# Altium project 模拟有线充电.PrjPcb
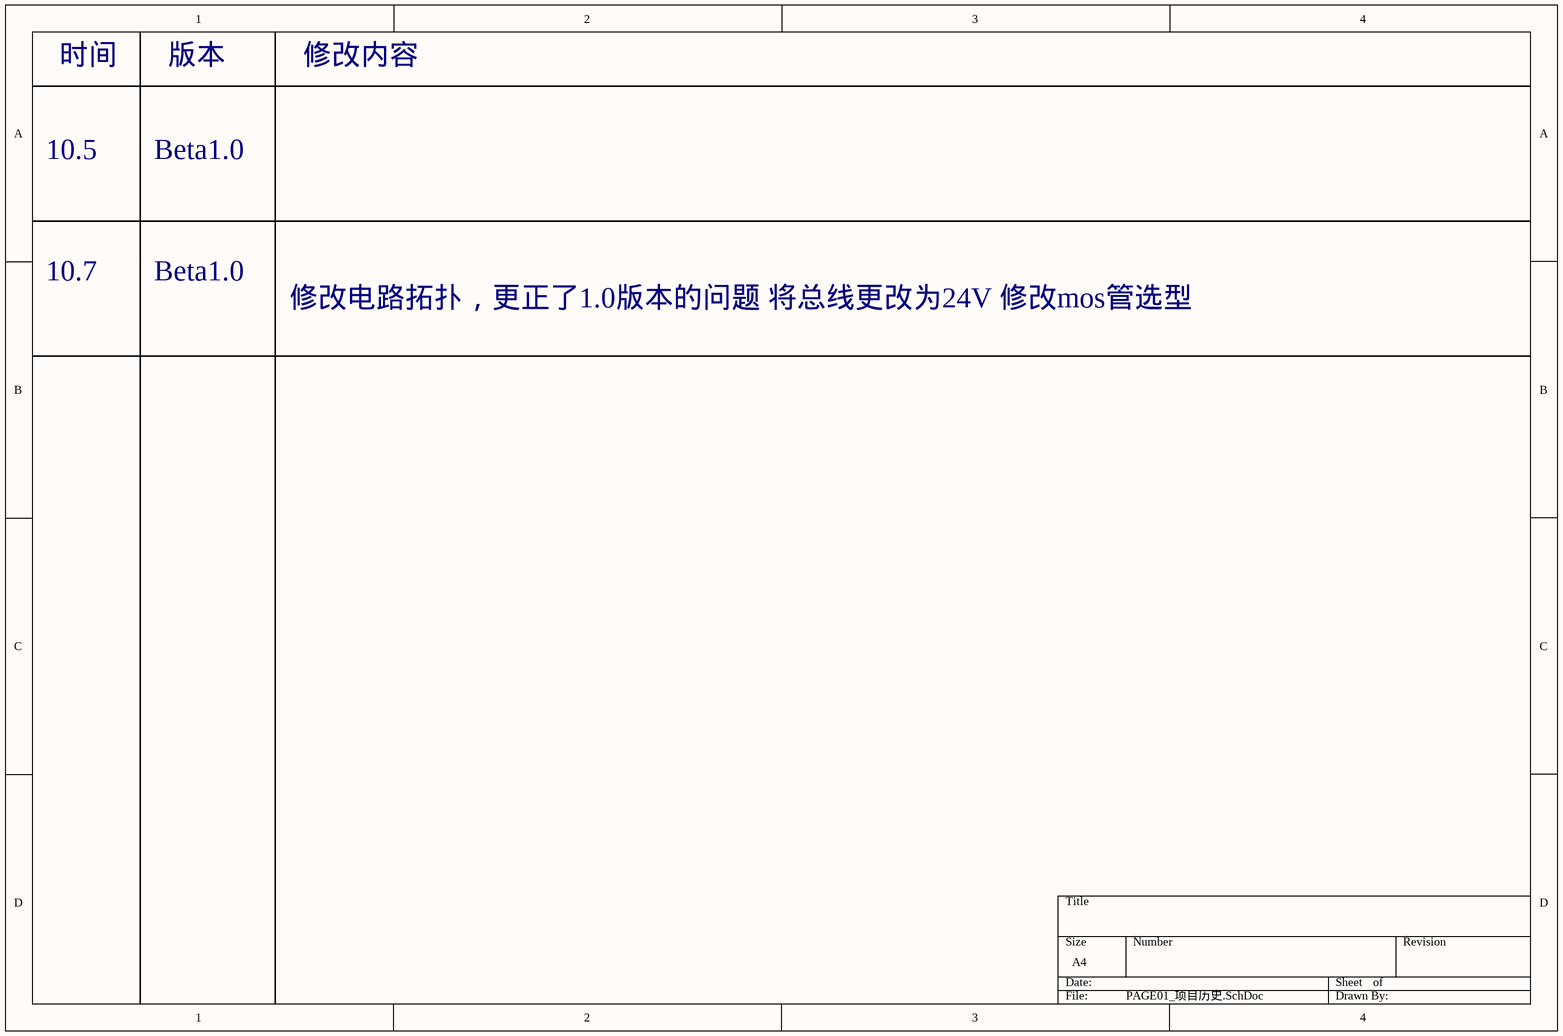
[diagram p0: PAGE01_项目历史.SchDoc]
6 sheets, 90 parts. Net scope: global (net labels, ports and power ports of the same name join across sheets).
Board file: PCB1.PcbDoc
Sheets:
  PAGE01_项目历史.SchDoc
  PAGE02_机场端电源.SchDoc
  PAGE03_机场端单片机.SchDoc
  PAGE04_飞机端BMS.SchDoc
  PAGE05_机场端协议.SchDoc
  PAGE06_握手协议飞机端.SchDoc

## Sheet PAGE01_项目历史.SchDoc
size A4

### Notes on the sheet
- 时间
- 版本
- 修改内容
- 10.5
- Beta1.0
- 10.7
- 修改电路拓扑，更正了1.0版本的问题 将总线更改为24V 修改mos管选型

## Sheet PAGE02_机场端电源.SchDoc
size A4
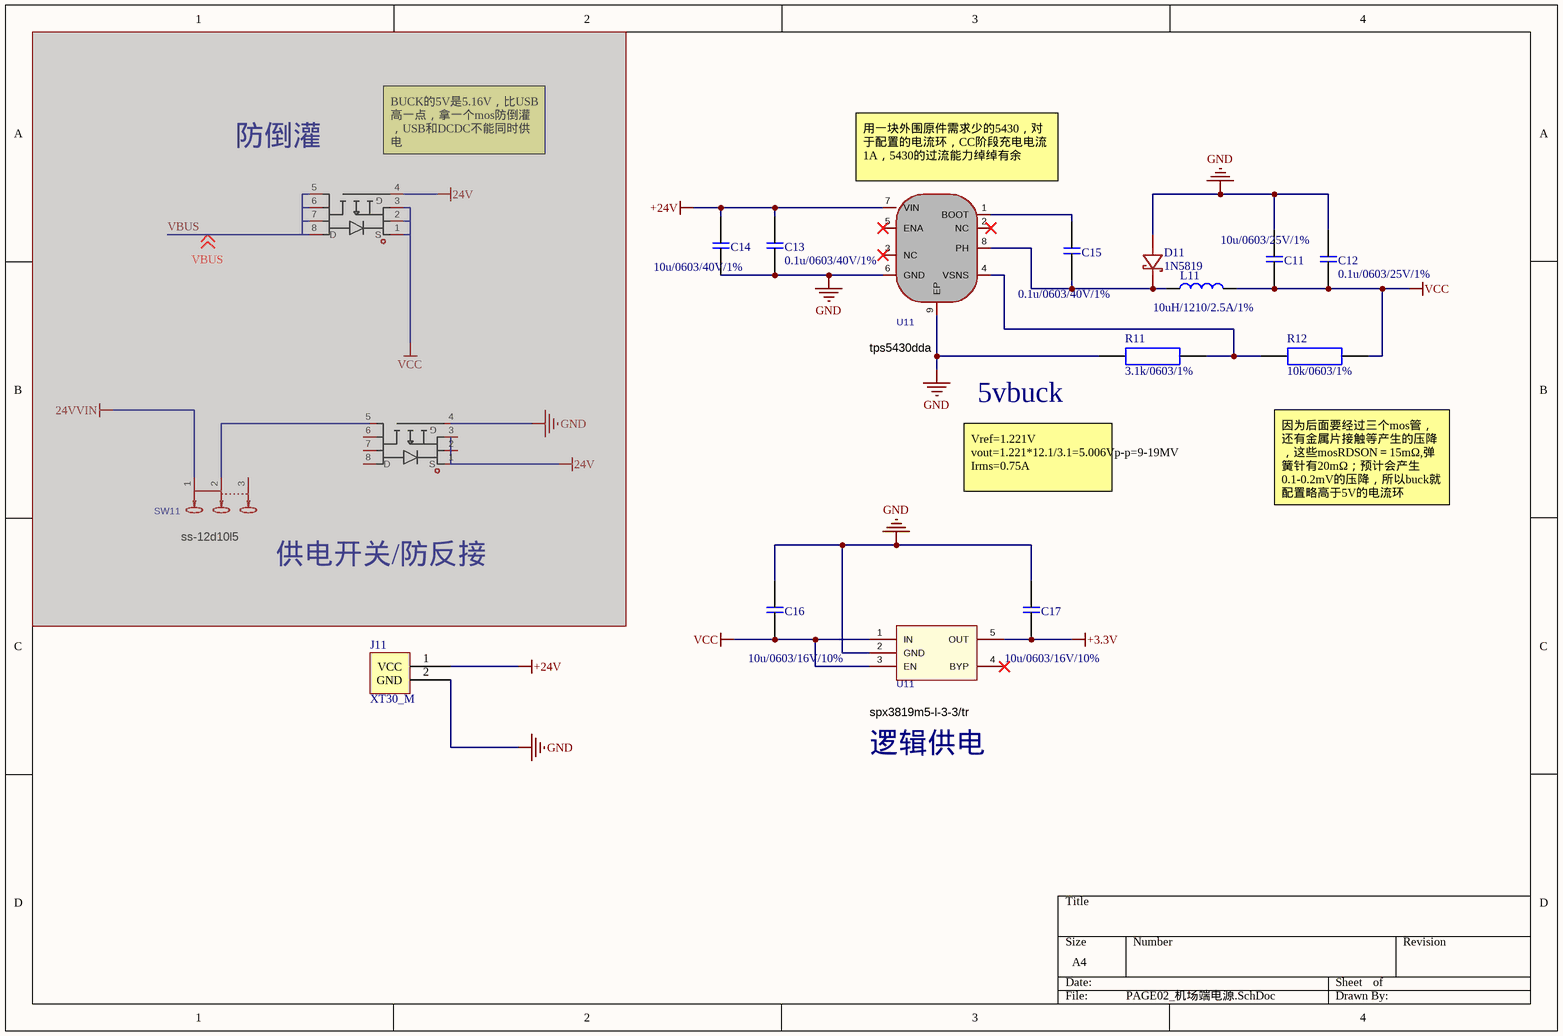
[diagram p1: PAGE02_机场端电源.SchDoc]

### Parts
(Parts that share a designator on the sheet are numbered #1, #2 ... from top to bottom, then left to right.)
C11  10u/0603/25V/1%  [0603_ding_C]
C12  0.1u/0603/25V/1%  [0603_ding_C]
C13  0.1u/0603/40V/1%  [0603_ding_C]
C14  10u/0603/40V/1%  [0603_ding_C]
C15  0.1u/0603/40V/1%  [0603_ding_C]
C16  10u/0603/16V/10%  [0603_ding_C]
C17  10u/0603/16V/10%  [0603_ding_C]
D11  1N5819  [SMA_L4.4-W2.6-LS5.0-RD]
J11  XT30_M  [XT30（立式）]
L11  10uH/1210/2.5A/1%  [1210_ding_C]
Q11  ao4435  [SOP-8_L5.0-W3.8-P1.27-LS6.0-BL]  (value not drawn)  (masked out: inside a compile mask, not in the netlist)
Q12  ao4435  [SOP-8_L5.0-W3.8-P1.27-LS6.0-BL]  (value not drawn)  (masked out: inside a compile mask, not in the netlist)
R11  3.1k/0603/1%  [0603_ding_R]
R12  10k/0603/1%  [0603_ding_R]
SW11  ss-12d10l5  [SW-TH_SS-12D10L5]  (masked out: inside a compile mask, not in the netlist)
U11#1  tps5430dda  [SOIC-8_EP_150mil]
U11#2  spx3819m5-l-3-3/tr  [SOT-23-5_L3.0-W1.7-P0.95-LS2.8-BL]

### Nets
+3.3V: C17.1 U11#2.5(OUT)
+24V: C13.2 C14.2 J11.1(VCC) U11#1.7(VIN)
GND: C11.2 C12.2 C13.1 C14.1 C16.2 C17.2 D11.2(A) J11.2(GND) R11.2 U11#1.6(GND) U11#1.9(EP) U11#2.2(GND)
VCC: C11.1 C12.1 C16.1 L11.2 R12.1 U11#2.1(IN) U11#2.3(EN)
NetC15_1: C15.1 U11#1.1(BOOT)
NetC15_2: C15.2 D11.1(C) L11.1 U11#1.8(PH)
NetR11_1: R11.1 R12.2 U11#1.4(VSNS)

Not connected (* = marked no-connect by the designer): U11#1 2(NC)* 3(NC)* 5(ENA)*; U11#2 4(BYP)*

### Notes on the sheet
- 防倒灌
- (near Q12) BUCK的5V是5.16V，比USB高一点，拿一个mos防倒灌，USB和DCDC不能同时供电
- (near U11#1) 用一块外围原件需求少的5430，对于配置的电流环，CC阶段充电电流1A，5430的过流能力绰绰有余
- 5vbuck
- Vref=1.221V
  vout=1.221*12.1/3.1=5.006Vp-p=9-19MV
  Irms=0.75A
- 因为后面要经过三个mos管，还有金属片接触等产生的压降，这些mosRDSON＝15mΩ,弹簧针有20mΩ；预计会产生0.1-0.2mV的压降，所以buck就配置略高于5V的电流环
- 供电开关/防反接
- 逻辑供电

### Library data of the parts
C11-C17 = C
L11 = L-ip6826
Q11 Q12 = ao4435: 数量:1个P沟道;漏源电压(Vdss):30V;连续漏极电流(Id):12A;导通电阻(RDS(on)):15mΩ@10V;耗散功率(Pd):2.5W;阈值电压(Vgs(th)):3V;; Manufacturer: UMW(友台半导体); Symbol: AO4435_C2944310; AddInBom: yes; ModelId: 823e4ad1ee284f09bfed9f55dae295e0; ModelTransform: 196.85,236.22,0,0,0,0,0,0,0; Number: 1个P沟道; Drain to Source Voltage: 30V; Current - Continuous Drain(Id): 12A; Pd - Power Dissipation: 2.5W; Gate Threshold Voltage (Vgs(th)): 3V; Gate Charge(Qg): 18nC; Input Capacitance(Ciss): 1.175nF; Reverse Transfer Capacitance (Crss@Vds): 190pF; Output Capacitance(Coss): 195pF; LCSC Part Name: 1个P沟道 耐压:30V 电流:12A; SupplierPart: C2944310; ManufacturerPart: AO4435; Supplier Footprint: SOP-8; JLCPCB Part Class: Extended Part; Datasheet: https://item.szlcsc.com/datasheet/AO4435/3330325.html; Supplier: LCSC; ConvertToPcb: yes; FootprintName: SOP-8_L5.0-W3.8-P1.27-LS6.0-BL; ModelName: SOP-8_L5.0-W3.8-P1.27-LS6.0-BL; RDS(on): 15mΩ@10V; Operating Temperature: -55℃~+150℃
R11 R12 = RES
SW11 = ss-12d10l5: 电路结构:单刀双掷;安装方式:直插;开关颜色:黑色;额定电流:3A;额定电压:125V;工作寿命:1万次;; Manufacturer: XKB Connection(中国星坤); AddInBom: yes; ModelId: c49f07a32c154ec8ad7cf47670a53981; ModelName: SW-TH_L13.0-W6.8-H6.4-P4.7; ModelTransform: 511.81394,267.716,0,0,0,0,0,0,-220.472; Circuit: 单刀双掷; Actuator Style: 矩形柱状; Switch Height: 6.4mm; Actuator Color: 黑色; Current Rating: 3A; Voltage Rating: 125V; Life: 1万次; Symbol: SS-12D10L5; LCSC Part Name: 柄长5mm 直插双档 滑动开关; SupplierPart: C319012; ManufacturerPart: SS-12D10L5; Supplier Footprint: 插件,13x6.8mm; JLCPCB Part Class: Extended Part; Datasheet: https://item.szlcsc.com/datasheet/SS-12D10L5/300104.html; Supplier: LCSC; ConvertToPcb: yes; FootprintName: SW-TH_SS-12D10L5; Termination Style: PC引脚; Length: 13mm; Width: 6.8mm; Mounting Type: 直插; Operating Temperature: -40℃~+85℃
U11#1 = tps5430dda: 功能类型:降压型;工作电压:5.5V~36V;输出电压:1.221V~32.04V;输出电流:3A;输出类型:可调;; Manufacturer: TI(德州仪器); AddInBom: yes; ModelId: 0078439d9e964752ad4b3f828dcb5664; ModelName: ESOP-8_L4.9-W3.9-P1.27-LS6.0-BL-EP-2; ModelTransform: 192.913,236.22,0,0,0,0,0,0,0; Function: 降压型; Output Current: 3A; Frequency - Switching: 500kHz; Synchronous Rectifier: 否; Number of Outputs: 1; Topology: 降压式; Quiescent Current: 4.4mA; Switch tube (built-in/external): 内置; Output Type: 可调; Symbol: TPS5430DDA; LCSC Part Name: 降压型 3A 5.5V~36V; SupplierPart: C502477; ManufacturerPart: TPS5430DDA; Supplier Footprint: ESOP-8; JLCPCB Part Class: Extended Part; Datasheet: https://www.ti.com/cn/lit/ds/symlink/tps5430.pdf; Supplier: LCSC; ConvertToPcb: yes; FootprintName: ESOP-8_L4.9-W3.9-P1.27-LS6.0-BL-EP-2; Voltage - Supply: 5.5V~36V; Output Voltage: 1.221V~32.04V; Operating Temperature: -40℃~+125℃@(TJ); Features: 逐波限流；过流保护；打嗝限流
U11#2 = spx3819m5-l-3-3/tr: 输出极性:正极;工作电压:16V;输出电压:3.3V;输出电流:500mA;电源纹波抑制比(PSRR):70dB;输出类型:固定;; Manufacturer: MaxLinear(迈凌); AddInBom: yes; ModelId: 0a2a1b8f50944f73965918ad6e5fe167; ModelName: SOT-23-5_L2.9-W1.6-H1.1-LS2.8-P0.95; ModelTransform: 118.60433,114.173,0,90,0,0,0.0005,0.0005,0; Output Configuration: 正极; Voltage - Supply: 16V; Output Voltage: 3.3V; Output Current: 500mA; Power Supply Rejection Ratio (PSRR): 70dB; Voltage Dropout: 340mV@(500mA); standby current: 90uA; Noise: 40uVrms; Output Type: 固定; Number of Outputs: 1; Symbol: SPX3819M5-L-3-3/TR; LCSC Part Name: 3.3V 500mA 16V; SupplierPart: C9055; ManufacturerPart: SPX3819M5-L-3-3/TR; Supplier Footprint: SOT-23-5; JLCPCB Part Class: Extended Part; Datasheet: https://item.szlcsc.com/datasheet/SPX3819M5-L-3-3%252FTR/9575.html; Supplier: LCSC; ConvertToPcb: yes; FootprintName: SOT-23-5_L3.0-W1.7-P0.95-LS2.8-BL; Features: 过流保护；反极性电压保护；使能控制；噪声旁路端子；热关断; Operating Temperature: -40℃~+125℃

## Sheet PAGE03_机场端单片机.SchDoc
size A4
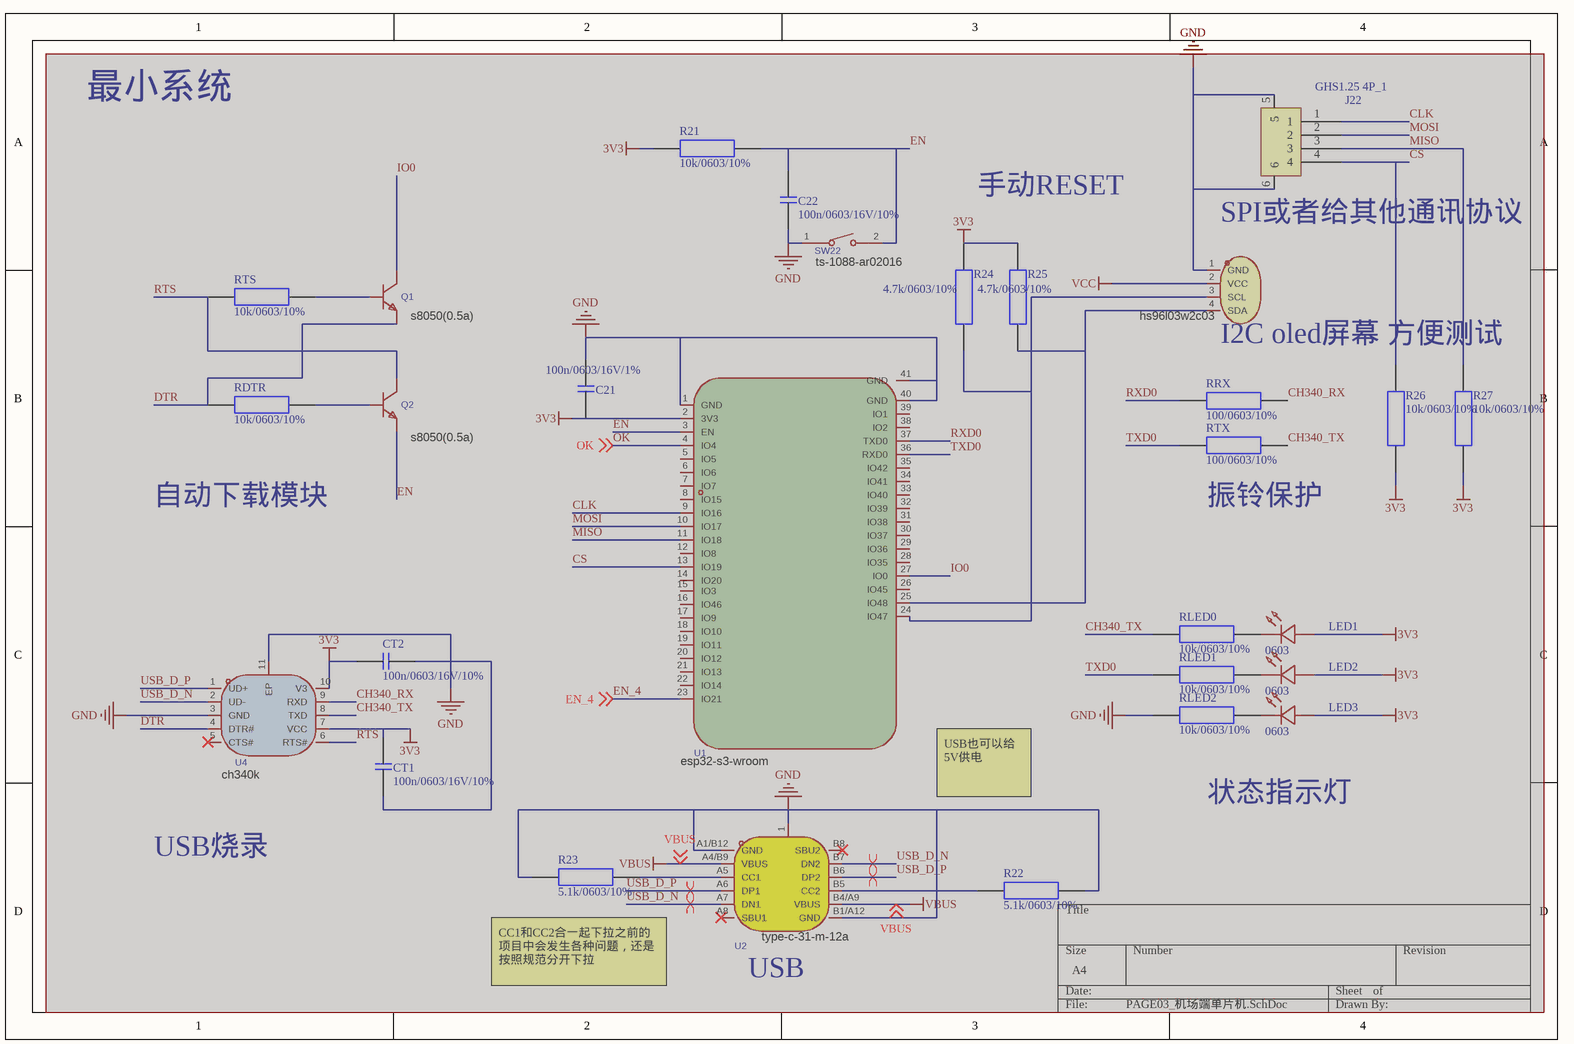
[diagram p2: PAGE03_机场端单片机.SchDoc]

### Parts
C21  100n/0603/16V/1%  [0603_ding_C]  (masked out: inside a compile mask, not in the netlist)
C22  100n/0603/16V/10%  [0603_ding_C]  (masked out: inside a compile mask, not in the netlist)
CT1  100n/0603/16V/10%  [0603_ding_C]  (masked out: inside a compile mask, not in the netlist)
CT2  100n/0603/16V/10%  [0603_ding_C]  (masked out: inside a compile mask, not in the netlist)
J22  GHS1.25 4P_1  [SM04B-GHS卧式]  (masked out: inside a compile mask, not in the netlist)
LED1  0603  [LED0603-RD_GREEN]  (masked out: inside a compile mask, not in the netlist)
LED2  0603  [LED0603-RD_GREEN]  (masked out: inside a compile mask, not in the netlist)
LED3  0603  [LED0603-RD_GREEN]  (masked out: inside a compile mask, not in the netlist)
Q1  s8050(0.5a)  [SOT-23-3_L2.9-W1.3-P1.90-LS2.4-BR]  (masked out: inside a compile mask, not in the netlist)
Q2  s8050(0.5a)  [SOT-23-3_L2.9-W1.3-P1.90-LS2.4-BR]  (masked out: inside a compile mask, not in the netlist)
R21  10k/0603/10%  [0603_ding_R]  (masked out: inside a compile mask, not in the netlist)
R22  5.1k/0603/10%  [0603_ding_R]  (masked out: inside a compile mask, not in the netlist)
R23  5.1k/0603/10%  [0603_ding_R]  (masked out: inside a compile mask, not in the netlist)
R24  4.7k/0603/10%  [0603_ding_R]  (masked out: inside a compile mask, not in the netlist)
R25  4.7k/0603/10%  [0603_ding_R]  (masked out: inside a compile mask, not in the netlist)
R26  10k/0603/10%  [0603_ding_R]  (masked out: inside a compile mask, not in the netlist)
R27  10k/0603/10%  [0603_ding_R]  (masked out: inside a compile mask, not in the netlist)
RDTR  10k/0603/10%  [0603_ding_R]  (masked out: inside a compile mask, not in the netlist)
RLED0  10k/0603/10%  [0603_ding_R]  (masked out: inside a compile mask, not in the netlist)
RLED1  10k/0603/10%  [0603_ding_R]  (masked out: inside a compile mask, not in the netlist)
RLED2  10k/0603/10%  [0603_ding_R]  (masked out: inside a compile mask, not in the netlist)
RRX  100/0603/10%  [0603_ding_R]  (masked out: inside a compile mask, not in the netlist)
RTS  10k/0603/10%  [0603_ding_R]  (masked out: inside a compile mask, not in the netlist)
RTX  100/0603/10%  [0603_ding_R]  (masked out: inside a compile mask, not in the netlist)
SW22  ts-1088-ar02016  [SW-SMD_L3.9-W3.0-P4.45]  (masked out: inside a compile mask, not in the netlist)
U1  esp32-s3-wroom  [WIRELM-SMD_ESP32-S3-WROOM-1]  (masked out: inside a compile mask, not in the netlist)
U2  type-c-31-m-12a  [USB-C-SMD_TYPE-C-31-M-12A]  (masked out: inside a compile mask, not in the netlist)
U4  ch340k  [ESOP-10_L4.9-W3.9-P1.00-LS6.2-BL-EP]  (masked out: inside a compile mask, not in the netlist)
U22  hs96l03w2c03  [OLED-TH_L27.8-W27.2-P2.54_C9900033791]  (masked out: inside a compile mask, not in the netlist)

### Layout directives
differential pair: (no net found under the mark)

### Notes on the sheet
- 最小系统
- 手动RESET
- (near J22) SPI或者给其他通讯协议
- (near U22) I2C oled屏幕 方便测试
- 自动下载模块
- (near RTX) 振铃保护
- (near U1) USB也可以给5V供电
- USB烧录
- 状态指示灯
- (near R23) CC1和CC2合一起下拉之前的项目中会发生各种问题，还是按照规范分开下拉
- (near U2) USB

### Library data of the parts
C21 C22 CT1 CT2 = C
J22 = GHS1.25 4P_1: 卧式短边
LED1-LED3 = LED0603
Q1 Q2 = s8050(0.5a): 晶体管类型:NPN;集电极电流(Ic):500mA;集射极击穿电压(Vceo):25V;耗散功率(Pd):300mW;直流电流增益(hFE):120;; Manufacturer: EIC; AddInBom: yes; ModelId: c62791f0466c4ae2a892c056b845b0ca; ModelName: SOT-23-3P_L2.9-W1.3-H1.0-LS2.4-P0.95; ModelTransform: 98.425,114.173,0,180,0,0,0.0005,-0.0005,0; type: NPN; Current - Collector(Ic): 500mA; Collector - Emitter Voltage VCEO: 25V; Pd - Power Dissipation: 300mW; DC Current Gain: 120; Transition frequency(fT): 150MHz; Current - Collector Cutoff: 100nA; Vce Saturation(VCE(sat)): 600mV; Emitter-Base Voltage(Vebo): 5V; Number: 1个NPN; Symbol: S8050(0.5A); LCSC Part Name: 电流:0.5A 电压:25V; SupplierPart: C3014350; ManufacturerPart: S8050(0.5A); Supplier Footprint: SOT-23; JLCPCB Part Class: Extended Part; Datasheet: https://item.szlcsc.com/datasheet/S8050(0.5A)/3524496.html; Supplier: LCSC; ConvertToPcb: yes; FootprintName: SOT-23-3_L2.9-W1.3-P1.90-LS2.4-BR
R21-R27 RDTR RLED0-RLED2 RRX RTS RTX = RES
SW22 = ts-1088-ar02016: 电路结构:单刀单掷;按钮形状:圆形按钮;作用力:1.6N;安装方式:立贴;开关长度:3.9mm;开关宽度:3mm;开关高度:2mm;带支架:不带支架;触点电流:50mA;额定电压:12V;带灯:-;工作寿命:10万次;; Manufacturer: XUNPU(讯普); AddInBom: yes; ModelId: b26698b69f274ffabef8a26c7d0e5dd1; ModelName: SW-SMD_L3.9-W2.9-H2.0-LS4.8; ModelTransform: 188.976,114.174,0,0,0,0,0,0,0; Circuit: 单刀单掷; Actuator Style: 圆形按钮; Operating Force: 1.6N; Switch Height: 2mm; with Bracket: 不带支架; Contact Current: 50mA; Voltage Rating: 12V; Actuator/Cap Color: 黑色; Life: 10万次; Symbol: TS-1088-AR02016; LCSC Part Name: 3.9*3*2mm 立贴 轻触开关; SupplierPart: C720477; ManufacturerPart: TS-1088-AR02016; Supplier Footprint: SMD,4x3mm; JLCPCB Part Class: Basic Part; Datasheet: https://item.szlcsc.com/datasheet/TS-1088-AR02016/763484.html; Supplier: LCSC; ConvertToPcb: yes; FootprintName: SW-SMD_L3.9-W3.0-P4.45; Mounting Type: 立贴; Length: 3.9mm; Width: 3mm; With Lamp: -; IP Rating: -; Termination Style: SMD接片; Operating Temperature: -30℃~+80℃
U1 = esp32-s3-wroom-1-n16r8: 核心芯片:ESP32-S3R8;频率:2.4GHz;天线形式:板载PCB天线;发射功率:20.5dBm;接收灵敏度:-103.5dBm;; Manufacturer: ESPRESSIF(乐鑫); Symbol: ESP32-S3-WROOM-1(N16R8); AddInBom: yes; ModelId: 481f5bdfc076422c9bb3c23c3ada9c17; ModelTransform: 708.73866,1003.97437,0,0,0,0,0,143.7,0; Interface Type: I2C；GPIO；UART；SPI；USB；I2S; Value: 2.4GHz; Voltage - Supply: 3V~3.6V; Receive  Current: 95mA; Send  Current: 355mA; LCSC Part Name: 不带固件 通用型Wi-Fi+低功耗蓝牙MCU模组; SupplierPart: C2913202; ManufacturerPart: ESP32-S3-WROOM-1-N16R8; Supplier Footprint: SMD,25.5x18mm; JLCPCB Part Class: Extended Part; Datasheet: https://item.szlcsc.com/datasheet/ESP32-S3-WROOM-1-N16R8/3198300.html; Supplier: LCSC; ConvertToPcb: yes; FootprintName: WIRELM-SMD_ESP32-S3-WROOM-1; ModelName: WIRELM-SMD_ESP32-S3-WROOM-1; Utilized IC / Part: ESP32-S3R8; Antenna Type: 板载PCB天线; Output Power: 20.5dBm; Sensitivity: -103.5dBm; Operating Temperature: -40℃~+65℃
U2 = type-c-31-m-12a: 连接器类型:Type-C;公母:母;安装方式:卧贴;触点数量:16P;端口数量:1;额定电流 - 电源:6A;工作温度:-30℃~+85℃;; Manufacturer: 韩国韩荣; AddInBom: yes; ModelId: 5328bfb13ed649e8a9ad528bb3d92809; ModelTransform: 351.9678,305.1175,0,0,0,0,0,-41.575,-39.37; Connector Type: Type-C; Gender: 母; Number of Contacts: 16P; Number of Ports: 1; Current Rating-Power: 6A; Voltage Rating: 20V; Connect-Disconnect Life: 1万次; Symbol: TYPE-C-31-M-12A; LCSC Part Name: Type-C 母 卧贴; SupplierPart: C5337088; ManufacturerPart: TYPE-C-31-M-12A; Supplier Footprint: SMD; JLCPCB Part Class: Extended Part; Datasheet: https://item.szlcsc.com/datasheet/TYPE-C-31-M-12A/6102654.html; Supplier: LCSC; ConvertToPcb: yes; FootprintName: USB-C-SMD_TYPE-C-31-M-12A; ModelName: USB-C-SMD_TYPE-C-31-M-12A; Mounting Type: 卧贴; Length: 7.35mm; Operating Temperature: -30℃~+85℃
U4 = ch340k: 应用功能:USB转串口;USB协议版本:USB 2.0;通道数:-;数据速率:2Mbps;; Manufacturer: WCH(南京沁恒); AddInBom: yes; ModelId: 154218974c894ddbb70273feac157d69; ModelName: ESOP-10_L4.9-W3.9-H1.4-P1.00-LS6.2-BL-EP; ModelTransform: 192.913,242.1255,0,0,0,0,0,0,0; Applications Function: USB转串口; USB Protocol: USB 2.0; Voltage - Supply: 3.3V；5V; Data Rate: 2Mbps; Symbol: CH340K; LCSC Part Name: USB转串口芯片CH340; SupplierPart: C968586; ManufacturerPart: CH340K; Supplier Footprint: ESSOP-10-150mil-1mm; JLCPCB Part Class: Extended Part; Datasheet: https://item.szlcsc.com/datasheet/CH340K/1056391.html; Supplier: LCSC; ConvertToPcb: yes; FootprintName: ESOP-10_L4.9-W3.9-P1.00-LS6.2-BL-EP; Number of Channels: -; Operating Temperature: -20℃~+70℃; Features: 可编程波特率；内置时钟发生器；断电保护；上电复位
U22 = hs96l03w2c03: 主控芯片:SSD1315芯片;接口类型:I2C;尺寸(inch):0.96;像素分辨率:128x64;; Manufacturer: HS(汉昇); AddInBom: yes; ModelId: bb65183306db4ca69fb52250be49b00e; ModelTransform: 1070.864,1094.486,0,0,0,0,0,-498.424,0; Interface: I2C; Dot Pixels: 128x64; Type of Drive: 无源(PMOLED); Display Range: 21.744x10.864mm; Display Color: 白色; Luminance: 180cd/m2; Symbol: HS96L03W2C03; LCSC Part Name: 0.96寸OLED显示屏窄白光IIC; SupplierPart: C5248080; ManufacturerPart: HS96L03W2C03; Supplier Footprint: -; JLCPCB Part Class: Extended Part; Datasheet: https://item.szlcsc.com/datasheet/HS96L03W2C03/5960631.html; Supplier: LCSC; ConvertToPcb: yes; FootprintName: OLED-TH_L27.8-W27.2-P2.54_C9900033791; ModelName: OLED-TH_L27.8-W27.2-P2.54_C9900033791; Controller Type: SSD1315芯片; Size: 0.96; Operating Temperature: -40℃~+70℃; Function: -; Quiescent Current: -

## Sheet PAGE04_飞机端BMS.SchDoc
size A4
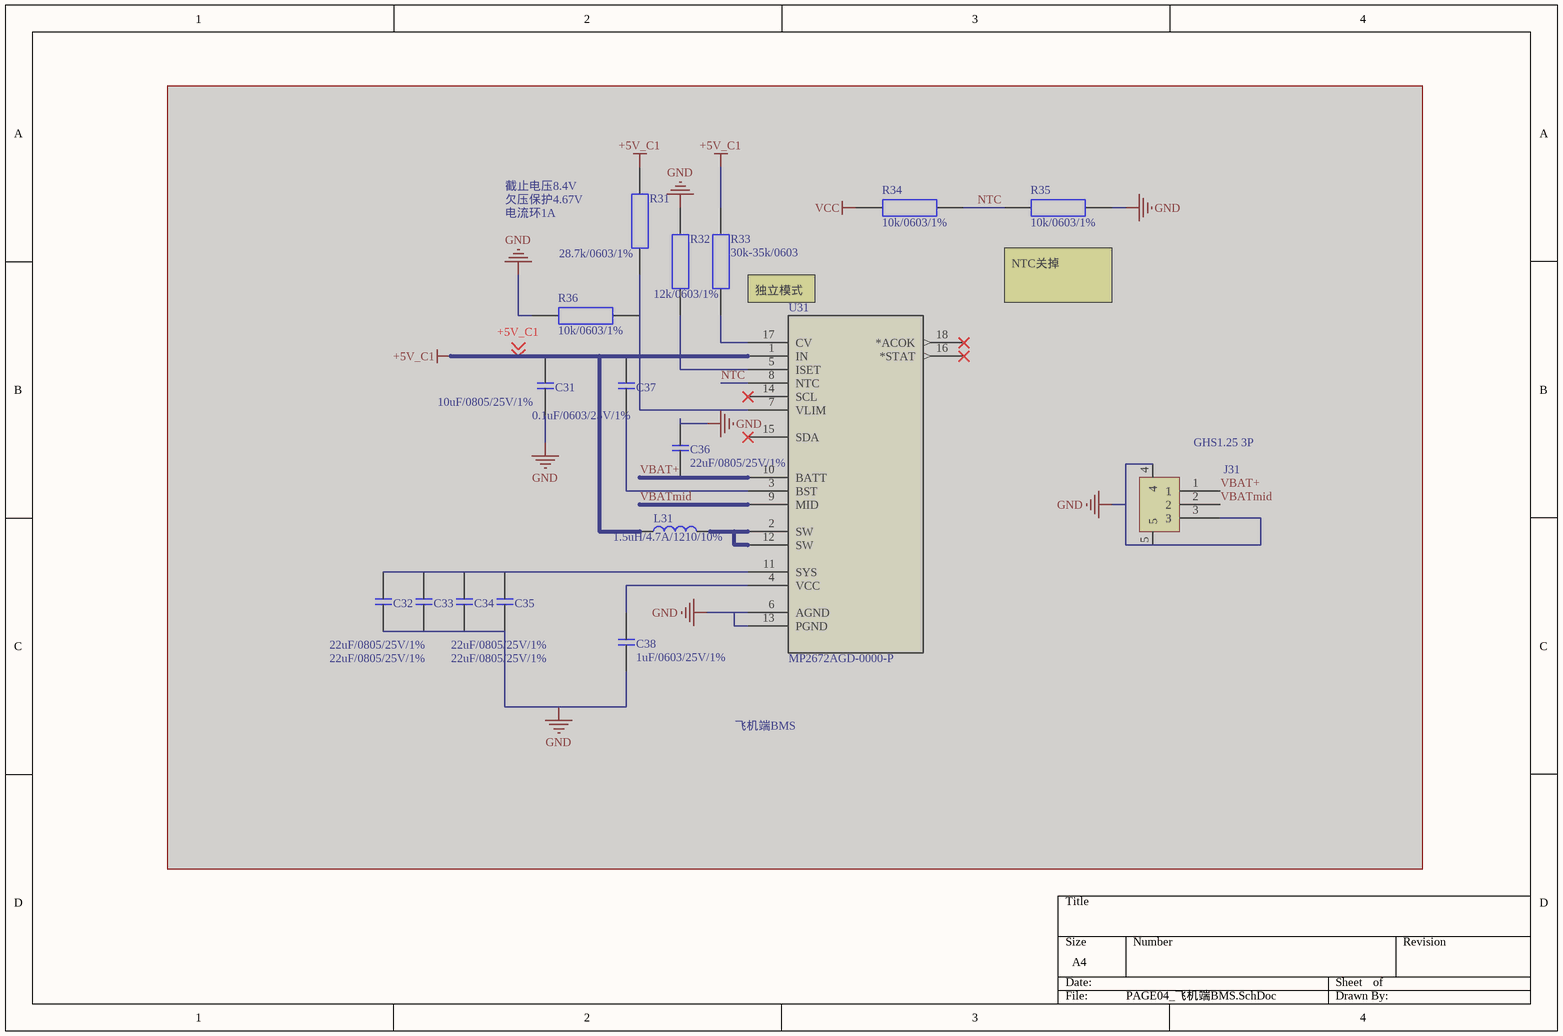
[diagram p3: PAGE04_飞机端BMS.SchDoc]

### Parts
C31  10uF/0805/25V/1%  [0603_ding_C]  (masked out: inside a compile mask, not in the netlist)
C32  22uF/0805/25V/1%  [0603_ding_C]  (masked out: inside a compile mask, not in the netlist)
C33  22uF/0805/25V/1%  [0603_ding_C]  (masked out: inside a compile mask, not in the netlist)
C34  22uF/0805/25V/1%  [0603_ding_C]  (masked out: inside a compile mask, not in the netlist)
C35  22uF/0805/25V/1%  [0603_ding_C]  (masked out: inside a compile mask, not in the netlist)
C36  22uF/0805/25V/1%  [0603_ding_C]  (masked out: inside a compile mask, not in the netlist)
C37  0.1uF/0603/25V/1%  [0603_ding_C]  (masked out: inside a compile mask, not in the netlist)
C38  1uF/0603/25V/1%  [0603_ding_C]  (masked out: inside a compile mask, not in the netlist)
J31  GHS1.25 3P  [SM03B_GHS立式]  (masked out: inside a compile mask, not in the netlist)
L31  1.5uH/4.7A/1210/10%  [1210_ding_C]  (masked out: inside a compile mask, not in the netlist)
R31  28.7k/0603/1%  [0603_ding_R]  (masked out: inside a compile mask, not in the netlist)
R32  12k/0603/1%  [0603_ding_R]  (masked out: inside a compile mask, not in the netlist)
R33  30k-35k/0603  [0603_ding_R]  (masked out: inside a compile mask, not in the netlist)
R34  10k/0603/1%  [0603_ding_R]  (masked out: inside a compile mask, not in the netlist)
R35  10k/0603/1%  [0603_ding_R]  (masked out: inside a compile mask, not in the netlist)
R36  10k/0603/1%  [0603_ding_R]  (masked out: inside a compile mask, not in the netlist)
U31  MP2672AGD-0000-P  [QFN-18_MP2672A_MNP]  (masked out: inside a compile mask, not in the netlist)

### Notes on the sheet
- 电流环1A
- 欠压保护4.67V
- 截止电压8.4V
- 独立模式
- (near R35) NTC关掉
- 飞机端BMS

### Library data of the parts
C31-C38 = C
J31 = GHS1.25 3P: 立式
L31 = L-ip6826
R31-R36 = RES
U31 = MP2672AGD-0000-P: 2A Boost Charger with NVDC Power Path Management and Integrated Cell Balancing for 2-Cell Li-Ion Batteries in Series; Manufacturer_Name: Monolithic Power Systems; Copyright: Copyright (C) 2026 Ultra Librarian. All rights reserved.; Manufacturer_Part_Number: MP2672AGD-0000-P; RefDes: RefDes; Type: Type

## Sheet PAGE05_机场端协议.SchDoc
size A4
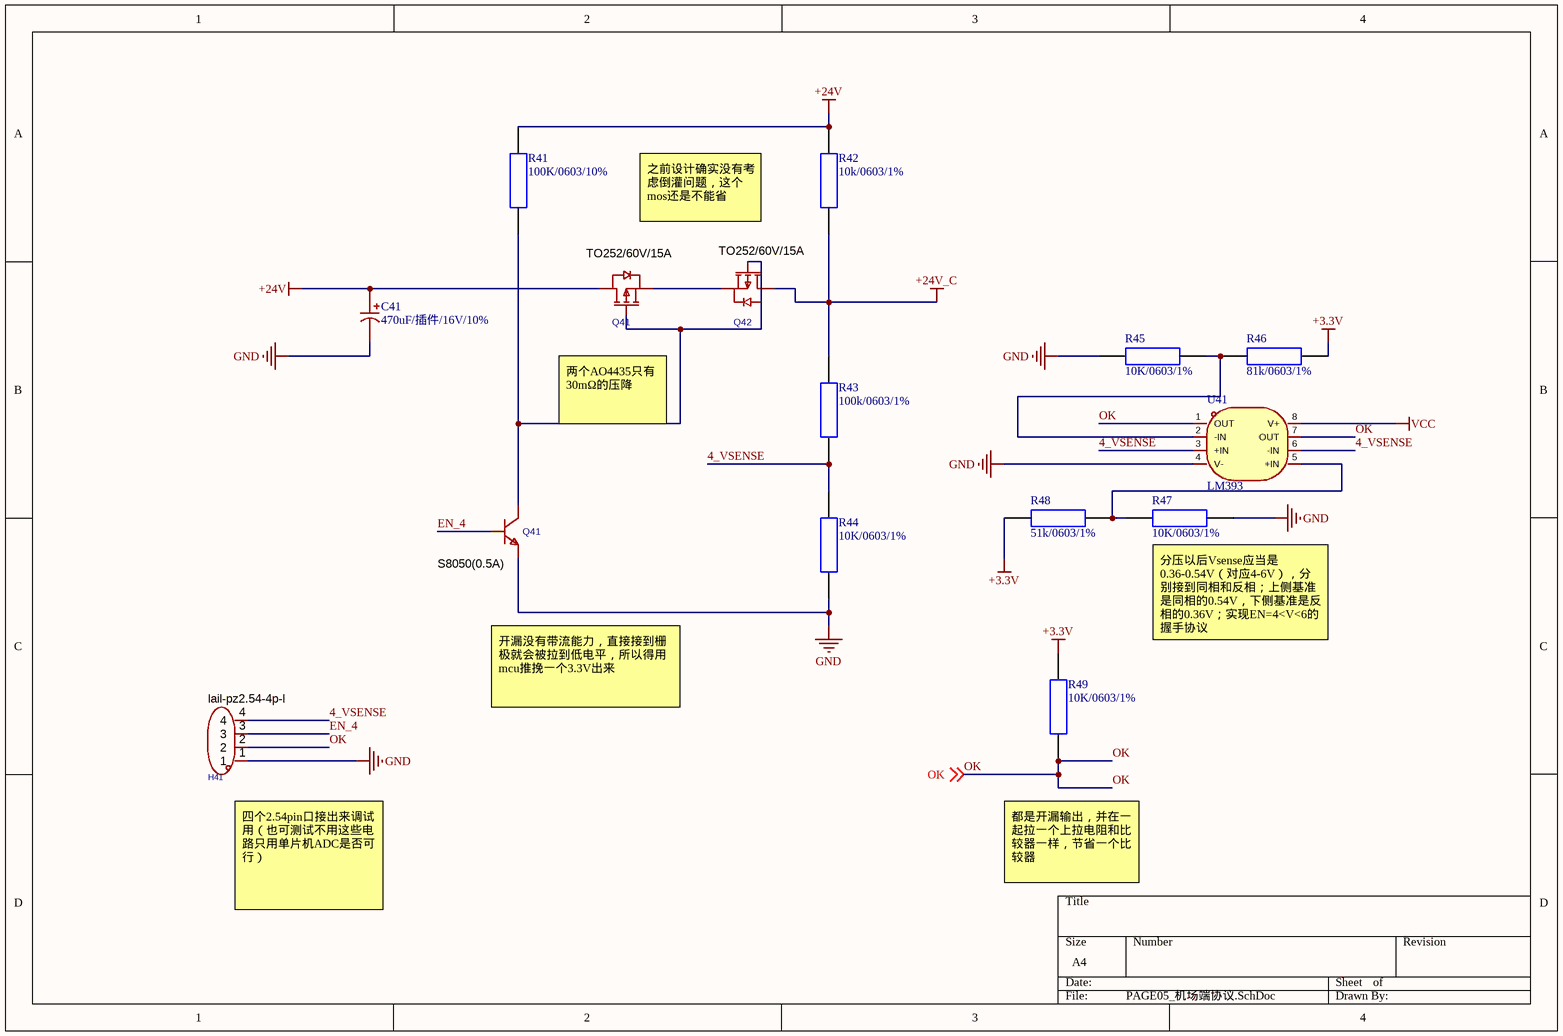
[diagram p4: PAGE05_机场端协议.SchDoc]

### Parts
(Parts that share a designator on the sheet are numbered #1, #2 ... from top to bottom, then left to right.)
C41  470uF/插件/16V/10%  [CAP-TH_BD10.0-P5.00-D0.6-FD-A]
H41  lail-pz2.54-4p-l  [CONN-TH_LAIL-PZ2.54-4P-L]
Q41#1  TO252/60V/15A  [TO-252-2_L6.6-W6.1-P4.57-LS9.9-BR-CW]
Q41#2  S8050(0.5A)  [SOT-23-3_L2.9-W1.3-P1.90-LS2.4-BR]
Q42  TO252/60V/15A  [TO-252-2_L6.6-W6.1-P4.57-LS9.9-BR-CW]
R41  100K/0603/10%  [0603_ding_R]
R42  10k/0603/1%  [0603_ding_R]
R43  100k/0603/1%  [0603_ding_R]
R44  10K/0603/1%  [0603_ding_R]
R45  10K/0603/1%  [0603_ding_R]
R46  81k/0603/1%  [0603_ding_R]
R47  10K/0603/1%  [0603_ding_R]
R48  51k/0603/1%  [0603_ding_R]
R49  10K/0603/1%  [0603_ding_R]
U41  LM393  [SOIC-8_L5.0-W4.0-P1.27-LS6.0-BL]

### Nets
+3.3V: R46.1 R48.1 R49.1
+24V: C41.1 Q41#1.2(D) R41.2 R42.2
+24V_C: Q42.2(D) R42.1 R43.2
GND: C41.2 H41.1 Q41#2.2(E) R44.1 R45.2 R47.2 U41.4(V-)
VCC: U41.8(V+)
4_VSENSE: H41.4 R43.1 R44.2 U41.3(+IN) U41.6(-IN)
EN_4: H41.3 Q41#2.1(B)
OK: H41.2 R49.2 U41.1(OUT) U41.7(OUT) ; off-sheet OK
NetQ41#1_1: Q41#1.1(G) Q41#2.3(C) Q42.1(G) R41.1
NetQ41#1_3: Q41#1.3(S) Q42.3(S)
NetR45_1: R45.1 R46.2 U41.2(-IN)
NetR47_1: R47.1 R48.2 U41.5(+IN)

### Notes on the sheet
- 之前设计确实没有考虑倒灌问题，这个mos还是不能省
- (near Q41#1) 两个AO4435只有30mΩ的压降
- (near R47) 分压以后Vsense应当是0.36-0.54V（对应4-6V），分别接到同相和反相；上侧基准是同相的0.54V，下侧基准是反相的0.36V；实现EN=4<V<6的握手协议
- 开漏没有带流能力，直接接到栅极就会被拉到低电平，所以得用mcu推挽一个3.3V出来
- (near H41) 四个2.54pin口接出来调试用（也可测试不用这些电路只用单片机ADC是否可行）
- 都是开漏输出，并在一起拉一个上拉电阻和比较器一样，节省一个比较器

### Library data of the parts
C41 = Cbig
H41 = lail-pz2.54-4p-l: 插针结构:1x4P;间距:2.54mm;圆针/方针:方针;安装方式:直插;排数:单排;总PIN位数:4P;额定电流:3A;额定电压:250V;配合针长度:6mm;塑高:2.5mm;端接针长度:3mm;触头材质:黄铜;触头镀层:金;工作温度:-25℃~+80℃;颜色:黑色;; Manufacturer: LAILAN(莱联); AddInBom: yes; ModelId: 112b012cb4004446aa5386c9c86d05f0; ModelTransform: 400.039,100,0,0,0,0,0,0,-118.11; Pin Structure: 1x4P; Pitch: 2.54mm; Circluar Pins/Square Pins: 方针; Current Rating: 3A; Voltage Rating (Max): 250V; LCSC Part Name: 1x4P 间距:2.54mm 方针 直插; SupplierPart: C54950602; ManufacturerPart: LAIL-PZ2.54-4P-L; Supplier Footprint: 插件,P=2.54mm; JLCPCB Part Class: Extended Part; Datasheet: https://item.szlcsc.com/datasheet/LAIL-PZ2.54-4P-L/58519955.html; Supplier: LCSC; ConvertToPcb: yes; SymbolName: LAIL-PZ2.54-4P-L; FootprintName: CONN-TH_LAIL-PZ2.54-4P-L; ModelName: CONN-TH_LAIL-PZ2.54-4P-L; Mounting Type: 直插; Number of Rows: 单排; Number of Pins: 4P; Length of Mating Pin: 6mm; Insulation Height: 2.5mm; Length of End Connection Pin: 3mm; Contact Material: 黄铜; Contact Plating: 金; Operating Temperature: -25℃~+80℃; Color: 黑色
Q41#1 Q42 = aod4185_c400894: 数量:1个P沟道;漏源电压(Vdss):40V;连续漏极电流(Id):40A;导通电阻(RDS(on)):15mΩ@10V;耗散功率(Pd):62.5W;阈值电压(Vgs(th)):3V;; Manufacturer: AOS; AddInBom: yes; ModelId: dee852f3c6b348a2b9d5be5dd3244081; ModelName: TO-252-3_L6.6-W6.1-P4.57-LS9.9-BR-CW; ModelTransform: 258.97184,390.1567,0,90,0,0,-35.433,0,0; Number: 1个P沟道; Drain to Source Voltage: 40V; Current - Continuous Drain(Id): 40A; Pd - Power Dissipation: 62.5W; Gate Threshold Voltage (Vgs(th)): 3V; Gate Charge(Qg): 55nC@10V; Input Capacitance(Ciss): 2.55nF; Reverse Transfer Capacitance (Crss@Vds): 190pF; Type: P沟道; Output Capacitance(Coss): 280pF; Vgs: ±20V; Symbol: AOD4185_C400894; LCSC Part Name: 1个P沟道 耐压:40V 电流:40A; SupplierPart: C400894; ManufacturerPart: AOD4185; Supplier Footprint: TO-252(DPAK); JLCPCB Part Class: Extended Part; Datasheet: https://item.szlcsc.com/datasheet/AOD4185/385415.html; Supplier: LCSC; ConvertToPcb: yes; FootprintName: TO-252-3_L6.6-W6.1-P4.57-LS9.9-BR-CW; RDS(on): 15mΩ@10V; Operating Temperature: -55℃~+175℃; Configuration: -
Q41#2 = s8050(0.5a): as Q1 on sheet PAGE03_机场端单片机; Symbol: S8050(0.5A); LCSC Part Name: 电流:0.5A 电压:25V; SupplierPart: C3014350; ManufacturerPart: S8050(0.5A); Supplier Footprint: SOT-23; JLCPCB Part Class: Extended Part; Datasheet: https://item.szlcsc.com/datasheet/S8050(0.5A)/3524496.html; Supplier: LCSC; ConvertToPcb: yes; FootprintName: SOT-23-3_L2.9-W1.3-P1.90-LS2.4-BR
R41-R49 = RES

## Sheet PAGE06_握手协议飞机端.SchDoc
size A4
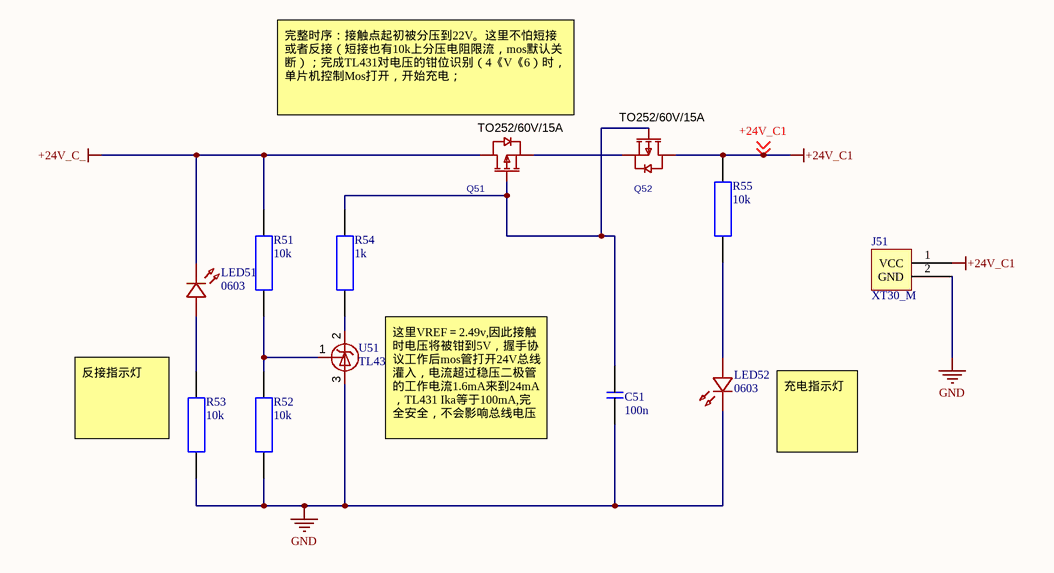
[diagram p5: PAGE06_握手协议飞机端.SchDoc]

### Parts
C51  100n  [0603_ding_C]
J51  XT30_M  [XT30（立式）]
LED51  0603  [LED0603-RD_GREEN]
LED52  0603  [LED0603-RD_GREEN]
Q51  TO252/60V/15A  [TO-252-2_L6.6-W6.1-P4.57-LS9.9-BR-CW]
Q52  TO252/60V/15A  [TO-252-2_L6.6-W6.1-P4.57-LS9.9-BR-CW]
R51  10k  [0603_ding_R]
R52  10k  [0603_ding_R]
R53  10k  [0603_ding_R]
R54  1k  [0603_ding_R]
R55  10k  [0603_ding_R]
U51  TL431  [SOT-23-3_L3.0-W1.6-P1.90-LS2.8-BR]

### Nets
+24V_C1: J51.1(VCC) Q52.2(D) R55.1 ; off-sheet +24V_C1
+24V_C_: LED51.1(C) Q51.2(D) R51.2
GND: C51.1 J51.2(GND) LED52.1(C) R52.1 R53.1 U51.3(A)
NetC51_2: C51.2 Q51.1(G) Q52.1(G) R54.2
NetLED51_2: LED51.2(A) R53.2
NetLED52_2: LED52.2(A) R55.2
NetQ51_3: Q51.3(S) Q52.3(S)
NetR51_1: R51.1 R52.2 U51.1(R)
NetR54_1: R54.1 U51.2(K)

### Notes on the sheet
- (near Q51) 完整时序：接触点起初被分压到22V。这里不怕短接或者反接（短接也有10k上分压电阻限流，mos默认关断）；完成TL431对电压的钳位识别（4《V《6）时，单片机控制Mos打开，开始充电；
- (near R53) 反接指示灯
- 这里VREF＝2.49v,因此接触时电压将被钳到5V，握手协议工作后mos管打开24V总线灌入，电流超过稳压二极管的工作电流1.6mA来到24mA，TL431 Ika等于100mA,完全安全，不会影响总线电压
- 充电指示灯

### Library data of the parts
C51 = C
LED51 LED52 = LED0603
Q51 Q52 = aod4185_c400894: as Q41#1 on sheet PAGE05_机场端协议; Symbol: AOD4185_C400894; LCSC Part Name: 1个P沟道 耐压:40V 电流:40A; SupplierPart: C400894; ManufacturerPart: AOD4185; Supplier Footprint: TO-252(DPAK); JLCPCB Part Class: Extended Part; Datasheet: https://item.szlcsc.com/datasheet/AOD4185/385415.html; Supplier: LCSC; ConvertToPcb: yes; FootprintName: TO-252-3_L6.6-W6.1-P4.57-LS9.9-BR-CW; RDS(on): 15mΩ@10V; Operating Temperature: -55℃~+175℃; Configuration: -
R51-R55 = RES

## Nets that join several sheets
+3.3V: PAGE02_机场端电源 (C17.1 U11#2.5), PAGE05_机场端协议 (R46.1 R48.1 R49.1)
+24V: PAGE02_机场端电源 (C13.2 C14.2 J11.1 U11#1.7), PAGE05_机场端协议 (C41.1 Q41#1.2 R41.2 R42.2)
GND: PAGE02_机场端电源 (12 pins), PAGE05_机场端协议 (7 pins), PAGE06_握手协议飞机端 (6 pins)
VCC: PAGE02_机场端电源 (7 pins), PAGE05_机场端协议 (U41.8)